# Altium project BM Tone Stack.PrjPcb
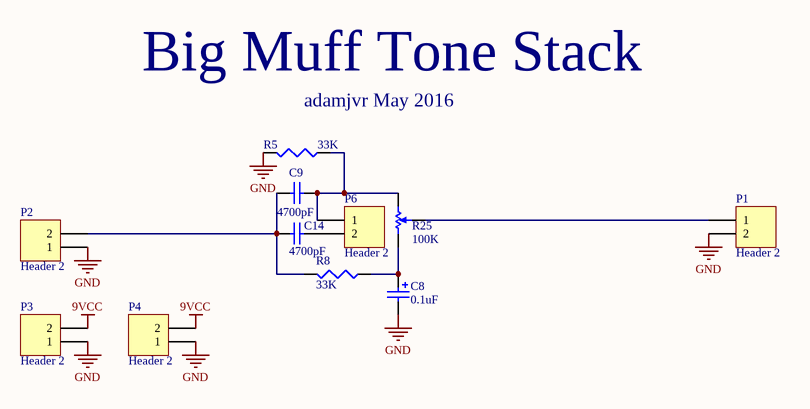
[diagram p0: BM Tone Stack.SchDoc]
1 sheet, 11 parts. Net scope: global (net labels, ports and power ports of the same name join across sheets).

## Sheet BM Tone Stack.SchDoc
size A

### Parts
C8  0.1uF  [5X12.5mmCAP]
C9  4700pF  [VY2472M49Y5US63V7]
C14  4700pF  [VY2472M49Y5US63V7]
P1  Header 2  [HDR1X2]
P2  Header 2  [HDR1X2]
P3  Header 2  [HDR1X2]
P4  Header 2  [HDR1X2]
P6  Header 2  [HDR1X2]
R5  33K  [R0805]
R8  33K  [R0805]
R25  100K  [BOURNS_PTD90SERIES_POT]

### Nets
9VCC: P3.2 P4.2
GND: C8.2 P1.2 P2.1 P3.1 P4.1 R5.2
NetC8_1: C8.1 R8.1 R25.3
NetC9_1: C9.1 P6.1 R5.1 R25.1
NetC9_2: C9.2 C14.2 P2.2 R8.2
NetC14_1: C14.1 P6.2
NetP1_1: P1.1 R25.2

### Notes on the sheet
- Big Muff Tone Stack
- (near R5) adamjvr May 2016

### Library data of the parts
C8 = UFG2A0R1MDM1TD: CAP ALUM 0.1UF 20% 100V RADIAL; MFR: Nichicon; Pin Count #: 2; Type: Aluminum Capacitor Throughhole; Lead-Free ?: Yes; Designer: Adam Vadala-Roth; MFR #: UFG2A0R1MDM1TD; Status: Active; Mounting: SMT/SMD; Datasheet: http://nichicon-us.com/english/products/pdfs/e-ufg.pdf; Height: 12.5mm; Tolerance: 20%; Cost: 0.08413 @ @ 1000; Voltage: 100V; Date Created: 9 May 2016; Last Modified: 9 May 2016; Value: 0.1uF
C9 C14 = VY2472M49Y5US63V7: 4700pF ±20% 440VAC Y5U (E) Ceramic Capacitor -40°C ~ 125°C Through Hole Radial, Disc 0.492" Dia (12.50mm); MFR: Vishay-BC-Components; Pin Count #: 2; Type: Ceramic Capacitor Throughole Disc; Lead-Free ?: Yes; Designer: Adam Vadala-Roth; MFR #: VY2472M49Y5US63V7; Status: Active; Mounting: SMT/SMD; Datasheet: http://www.vishay.com/docs/28535/vy2series.pdf; Height: 16.5mm; Tolerance: 20%; Cost: 0.10697 @ 1000; Voltage: 440VAC; Date Created: 10 May 2016; Last Modified: 10 May 2016; Value: 4700pF; Digikey #: BC2359-ND
P1-P4 P6 = Header 2: Header, 2-Pin; LatestRevisionDate: 17-Jul-2002; LatestRevisionNote: Re-released for DXP Platform.; Publisher: Altium Limited
R5 R8 = ERJ-6ENF3302V: RES SMD 33K OHM 1% 1/8W 0805; MFR: Panasonic-Electronic-Components; Pin Count #: 2; Lead-Free ?: Yes; Designer: Adam Vadala-Roth; MFR #: ERJ-6ENF3302V; Status: Active; Mounting: SMT/SMD; Datasheet: http://industrial.panasonic.com/www-cgi/jvcr13pz.cgi?E+PZ+3+AOA0002+ERJ6ENF3302V+7+WW; Height: 0.7mm; Tolerance: 1%; Cost: 0.00729; Type: Chip Resistor 0805; Voltage: 1/8W; Date Created: 9 May 2016; Last Modified: 9 May 2016; Value: 33K
R25 = PTD901-2015K-B104: POT 100K OHM 1/20W CARBON LINEAR; MFR: Bourns Inc.; Pin Count #: 3; Tolerance: 20%; Lead-Free ?: Yes; Designer: Adam Vadala-Roth; MFR #: PTD901-2015K-B104; Status: Active; Mounting: Through Hole; Datasheet: http://www.bourns.com/docs/Product-Datasheets/PTD90.pdf; Height: 11mm; Cost: 0.91800	 @ 1000; Type: Throughhole Potentiometer; Voltage: 1/20W; Date Created: 10 May 2016; Last Modified: 10 May 2016; Value: 100K